# EAGLE schematic musicbox (EAGLE 6.1)
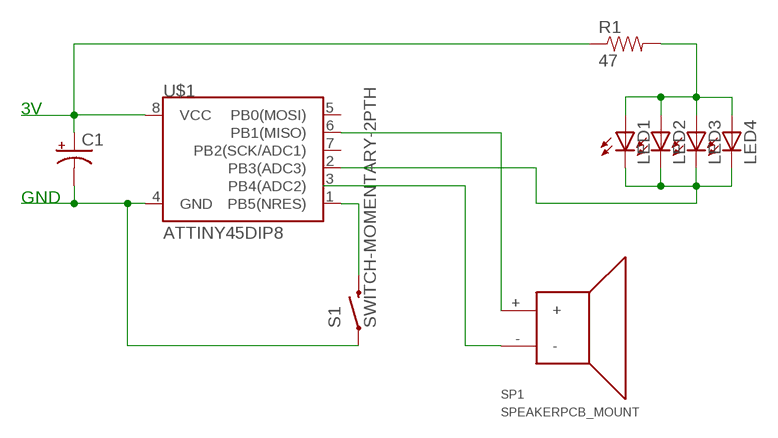
[diagram p0: schematic, sheet 1]

## Parts
C1  CAP_POLPTH2  [CPOL-RADIAL-10UF-25V]
LED1  LED5MM  [LED5MM]
LED2  LED5MM  [LED5MM]
LED3  LED5MM  [LED5MM]
LED4  LED5MM  [LED5MM]
R1  47  RESISTORPTH-1/6W  [1/6W-RES]
S1  SWITCH-MOMENTARY-2PTH  [TACTILE-PTH]
SP1  SPEAKERPCB_MOUNT  [PCB_MOUNT_SPEAKER]
U$1  ATTINY45DIP8  [DIP08]

## Nets
N$1: C1.1(+) R1.1 U$1.8(VCC)
N$2: LED1.A LED2.A LED3.A LED4.A R1.2
N$3: LED1.K(C) LED2.K(C) LED3.K(C) LED4.K(C) U$1.2(PB3(ADC3))
N$4: SP1.+ U$1.6(PB1(MISO))
N$5: SP1.-
N$6: S1.3 U$1.1(PB5(NRES))
N$7: C1.2(-) S1.1 U$1.4(GND)
Unconnected: U$1.3(PB4(ADC2)) U$1.5(PB0(MOSI)) U$1.7(PB2(SCK/ADC1))

## Notes on the sheet
- 3V
- GND

## Library data of the parts
C1 = SparkFun-Passives:CAP_POL: Capacitor Polarized These are standard SMD and PTH capacitors. Normally 10uF, 47uF, and 100uF in electrolytic and tantalum varieties. Always verify the external diameter of the through hole cap, it varies with capacity, voltage, and manufacturer. The EIA devices should be standard.
LED1-LED4 = SparkFun-LED:LED: LEDs Standard schematic elements and footprints for 5mm, 3mm, 1206, and 0603 sized LEDs. 5mm - Spark Fun Electronics SKU : COM-00529 (and others)
R1 = SparkFun-Passives:RESISTOR: Resistor Basic schematic elements and footprints for 0603, 1206, and PTH resistors.
S1 = SparkFun-Electromechanical:SWITCH-MOMENTARY-2: Various NO switches- pushbuttons, reed, etc
SP1 = SparkFun-Electromechanical:SPEAKER: General speakers.; MFG: SANCO; PROD_#: NA; SKU: COM-11089; SPARKLE_ID: 6504
U$1 = SparkFun-DigitalIC:ATTINY45: Atmel 8-pin 2/4/8kB flash uC